# EAGLE schematic Lab1_oppgave2 (EAGLE 8.0.0)

## Sheet 1 of 3
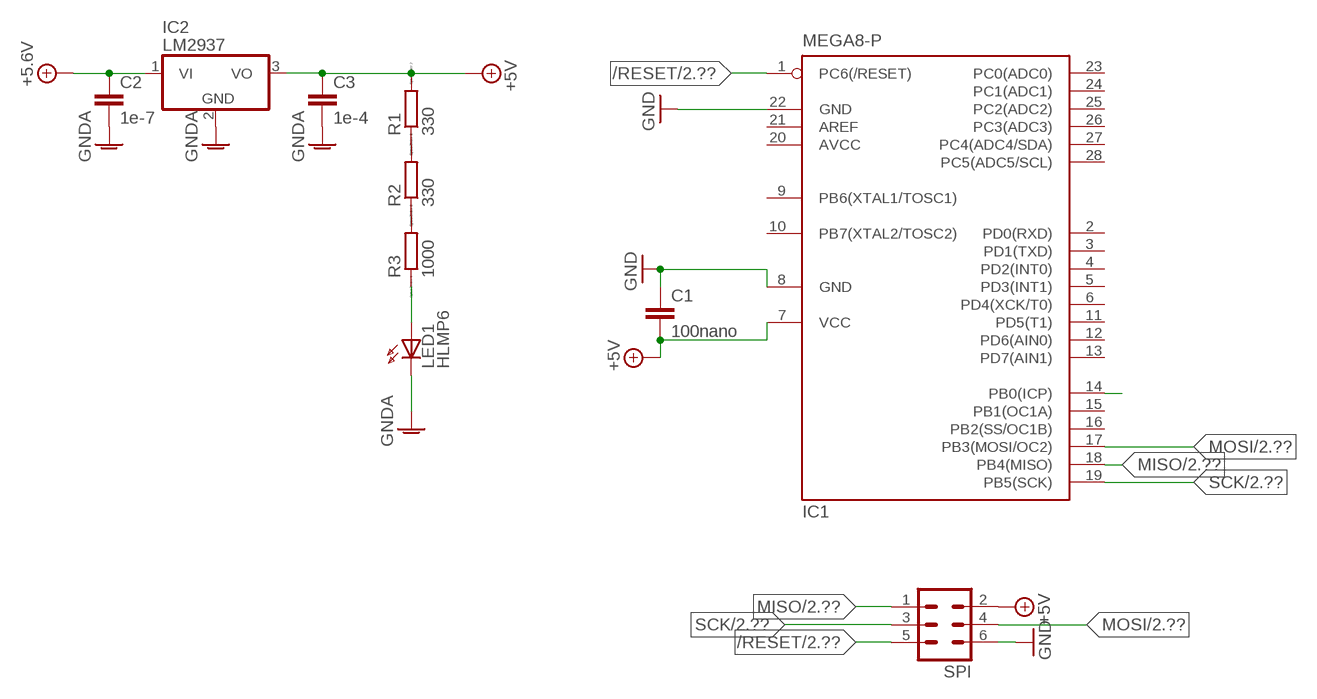
[diagram p0: schematic, sheet 1]

### Parts
C1  100nano  C2,5-3  [C2.5-3]
C2  1e-7  C2,5-3  [C2.5-3]
C3  1e-4  C2,5-3  [C2.5-3]
IC1  MEGA8-P  [DIL28-3]
IC2  LM2937  [TO263-3]
LED1  HLMP6  [HLMP6]
R1  330  R  [R0805]
R2  330  R0204/7  [0204/7]
R3  1000  R0204/7  [0204/7]
SPI  MA03-2  [MA03-2]

### Nets
+5V: C1.2 C2.1 C3.1 IC1.7(VCC) IC2.1(VI) IC2.3(VO) R1.2 SPI.2 ; supply symbol labelled +5.6V ; also sheet 2,3
/RESET: IC1.1(PC6(/RESET)) SPI.5 ; also sheet 2,3
GND: C1.1 IC1.8(GND) IC1.22(GND) SPI.6 ; also sheet 2,3
GNDA: C2.2 C3.2 IC2.2(GND) LED1.K ; also sheet 2,3
MISO: IC1.18(PB4(MISO)) SPI.1 ; also sheet 2,3
MOSI: IC1.17(PB3(MOSI/OC2)) SPI.4 ; also sheet 2,3
N$1: LED1.A R3.1
N$2: IC1.14(PB0(ICP))
N$3: R1.1 R2.2
N$4: R2.1 R3.2
SCK: IC1.19(PB5(SCK)) SPI.3 ; also sheet 2,3
Unconnected: IC1.2(PD0(RXD)) IC1.3(PD1(TXD)) IC1.4(PD2(INT0)) IC1.5(PD3(INT1)) IC1.6(PD4(XCK/T0)) IC1.9(PB6(XTAL1/TOSC1)) IC1.10(PB7(XTAL2/TOSC2)) IC1.11(PD5(T1)) IC1.12(PD6(AIN0)) IC1.13(PD7(AIN1)) IC1.15(PB1(OC1A)) IC1.16(PB2(SS/OC1B)) IC1.21(AREF) IC1.23(PC0(ADC0)) IC1.24(PC1(ADC1)) IC1.25(PC2(ADC2)) IC1.26(PC3(ADC3)) IC1.27(PC4(ADC4/SDA)) IC1.28(PC5(ADC5/SCL))

## Sheet 2 of 3
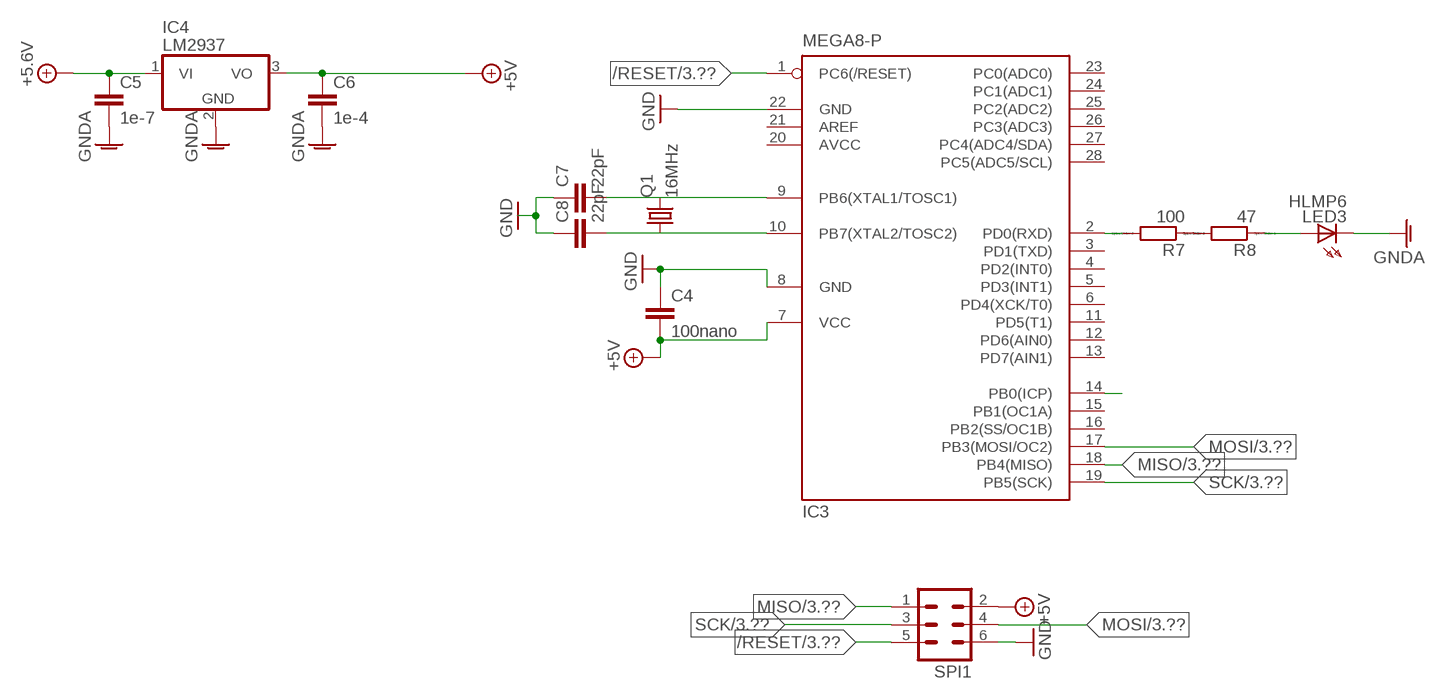
[diagram p1: schematic, sheet 2]

### Parts
C4  100nano  C2,5-3  [C2.5-3]
C5  1e-7  C2,5-3  [C2.5-3]
C6  1e-4  C2,5-3  [C2.5-3]
C7  22pF  C2,5-3  [C2.5-3]
C8  22pF  C2,5-3  [C2.5-3]
IC3  MEGA8-P  [DIL28-3]
IC4  LM2937  [TO263-3]
LED3  HLMP6  [HLMP6]
Q1  16MHz  CRYSTALHC49S  [HC49/S]
R7  100  R  [R0805]
R8  47  R0204/7  [0204/7]
SPI1  MA03-2  [MA03-2]

### Nets
+5V: C4.2 C5.1 C6.1 IC3.7(VCC) IC4.1(VI) IC4.3(VO) SPI1.2 ; supply symbol labelled +5.6V ; also sheet 1,3
/RESET: IC3.1(PC6(/RESET)) SPI1.5 ; also sheet 1,3
GND: C4.1 C7.1 C8.1 IC3.8(GND) IC3.22(GND) SPI1.6 ; also sheet 1,3
GNDA: C5.2 C6.2 IC4.2(GND) LED3.K ; also sheet 1,3
MISO: IC3.18(PB4(MISO)) SPI1.1 ; also sheet 1,3
MOSI: IC3.17(PB3(MOSI/OC2)) SPI1.4 ; also sheet 1,3
N$5: C7.2 IC3.9(PB6(XTAL1/TOSC1)) Q1.2
N$6: IC3.14(PB0(ICP))
N$7: C8.2 IC3.10(PB7(XTAL2/TOSC2)) Q1.1
N$9: LED3.A
N$10: R7.1 R8.2
N$12: IC3.2(PD0(RXD)) R7.2
SCK: IC3.19(PB5(SCK)) SPI1.3 ; also sheet 1,3
Unconnected: IC3.3(PD1(TXD)) IC3.4(PD2(INT0)) IC3.5(PD3(INT1)) IC3.6(PD4(XCK/T0)) IC3.11(PD5(T1)) IC3.12(PD6(AIN0)) IC3.13(PD7(AIN1)) IC3.15(PB1(OC1A)) IC3.16(PB2(SS/OC1B)) IC3.21(AREF) IC3.23(PC0(ADC0)) IC3.24(PC1(ADC1)) IC3.25(PC2(ADC2)) IC3.26(PC3(ADC3)) IC3.27(PC4(ADC4/SDA)) IC3.28(PC5(ADC5/SCL)) R8.1

## Sheet 3 of 3
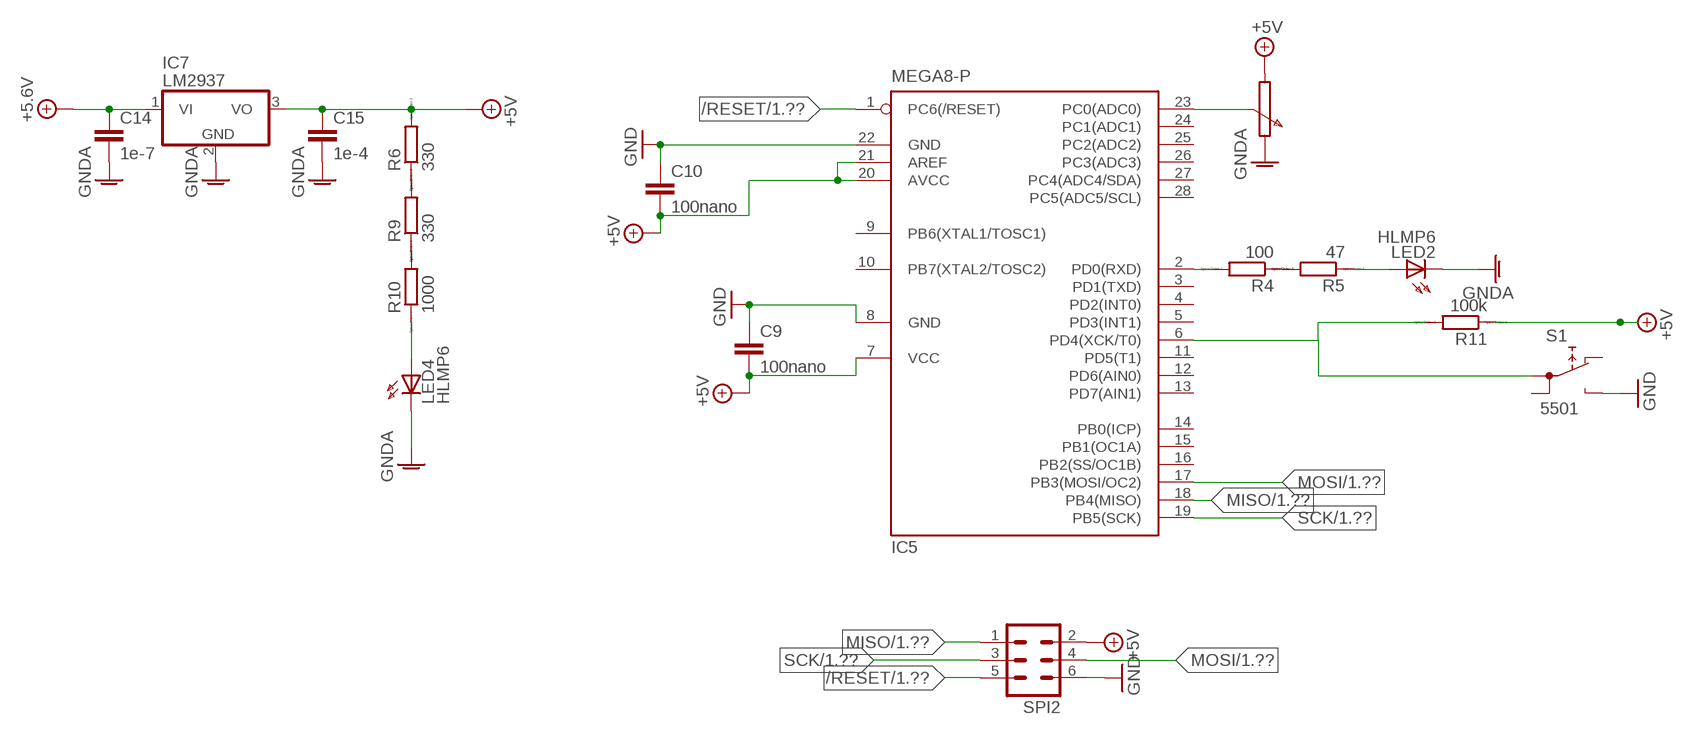
[diagram p2: schematic, sheet 3]

### Parts
C9  100nano  C2,5-3  [C2.5-3]
C10  100nano  C2,5-3  [C2.5-3]
C14  1e-7  C2,5-3  [C2.5-3]
C15  1e-4  C2,5-3  [C2.5-3]
IC5  MEGA8-P  [DIL28-3]
IC7  LM2937  [TO263-3]
LED2  HLMP6  [HLMP6]
LED4  HLMP6  [HLMP6]
R4  100  R  [R0805]
R5  47  R0204/7  [0204/7]
R6  330  R  [R0805]
R9  330  R0204/7  [0204/7]
R10  1000  R0204/7  [0204/7]
R11  100k  R  [R0805]
S1  5501  [5501]
SPI2  MA03-2  [MA03-2]

### Nets
+5V: C9.2 C10.2 C14.1 C15.1 IC5.7(VCC) IC5.20(AVCC) IC5.21(AREF) IC7.1(VI) IC7.3(VO) R6.2 R11.1 SPI2.2 ; supply symbol labelled +5.6V ; also sheet 1,2
/RESET: IC5.1(PC6(/RESET)) SPI2.5 ; also sheet 1,2
GND: C9.1 C10.1 IC5.8(GND) S1.NO SPI2.6 ; also sheet 1,2
GNDA: C14.2 C15.2 IC7.2(GND) LED2.K LED4.K ; also sheet 1,2
MISO: IC5.18(PB4(MISO)) SPI2.1 ; also sheet 1,2
MOSI: IC5.17(PB3(MOSI/OC2)) SPI2.4 ; also sheet 1,2
N$8: IC5.23(PC0(ADC0))
N$11: LED2.A
N$13: R4.1 R5.2
N$14: IC5.2(PD0(RXD)) R4.2
N$17: LED4.A R10.1
N$18: R6.1 R9.2
N$19: R9.1 R10.2
N$20: IC5.6(PD4(XCK/T0)) R11.2 S1.1A
SCK: IC5.19(PB5(SCK)) SPI2.3 ; also sheet 1,2
Unconnected: IC5.3(PD1(TXD)) IC5.4(PD2(INT0)) IC5.5(PD3(INT1)) IC5.9(PB6(XTAL1/TOSC1)) IC5.10(PB7(XTAL2/TOSC2)) IC5.11(PD5(T1)) IC5.12(PD6(AIN0)) IC5.13(PD7(AIN1)) IC5.14(PB0(ICP)) IC5.15(PB1(OC1A)) IC5.16(PB2(SS/OC1B)) IC5.24(PC1(ADC1)) IC5.25(PC2(ADC2)) IC5.26(PC3(ADC3)) IC5.27(PC4(ADC4/SDA)) IC5.28(PC5(ADC5/SCL)) R5.1 S1.1B S1.NC

## Power pins joined to a net without a drawn wire
AVCC: IC1.20(AVCC) IC3.20(AVCC)
GND: IC5.22(GND)

## Library data of the parts
C1-C10 C14 C15 = capacitor-wima:C: CAPACITOR naming: grid - package width
IC1 IC3 IC5 = atmel:MEGA8-P: MICROCONTROLLER 8 Kbytes FLASH, 1 kbytes SRAM, 512 bytes EEPROM, USART, 4-channel 10 bit ADC, 2-channel 8 bit ADC Pin compatible with Atmega48, ATMega88, ATMega168 Source: avr.lbr; OC_FARNELL: unknown; OC_NEWARK: unknown
IC2 IC4 IC7 = linear:LM2937: LM2937-2.5, LM2937-3.3 400mA and 500mA Voltage Regulators Source: http://cache.national.com/ds/LM/LM2937-2.5.pdf
LED1-LED4 = display-hp:HLMP6: LED 2mm horizontal; MF: AGILENT TECHNOLOGIES; MPN: HLMP-6500; OC_FARNELL: 1652490; OC_NEWARK: 40K0088
Q1 = crystal:CRYSTAL: CRYSTAL; OC_FARNELL: 1667008; OC_NEWARK: unknown
R1-R11 = eagle-ltspice:R: RESISTOR, European symbol; SPICEMODEL: NONE; SPICEPREFIX: R
S1 = switch:55?: PUSHBUTTON SERIES 5500 SWITCHES Source: www.e-switch.com .. 5500.pdf
SPI SPI1 SPI2 = con-lstb:MA03-2: PIN HEADER; OC_FARNELL: unknown; OC_NEWARK: unknown